# EAGLE schematic STM32F103RB (EAGLE 6.2)
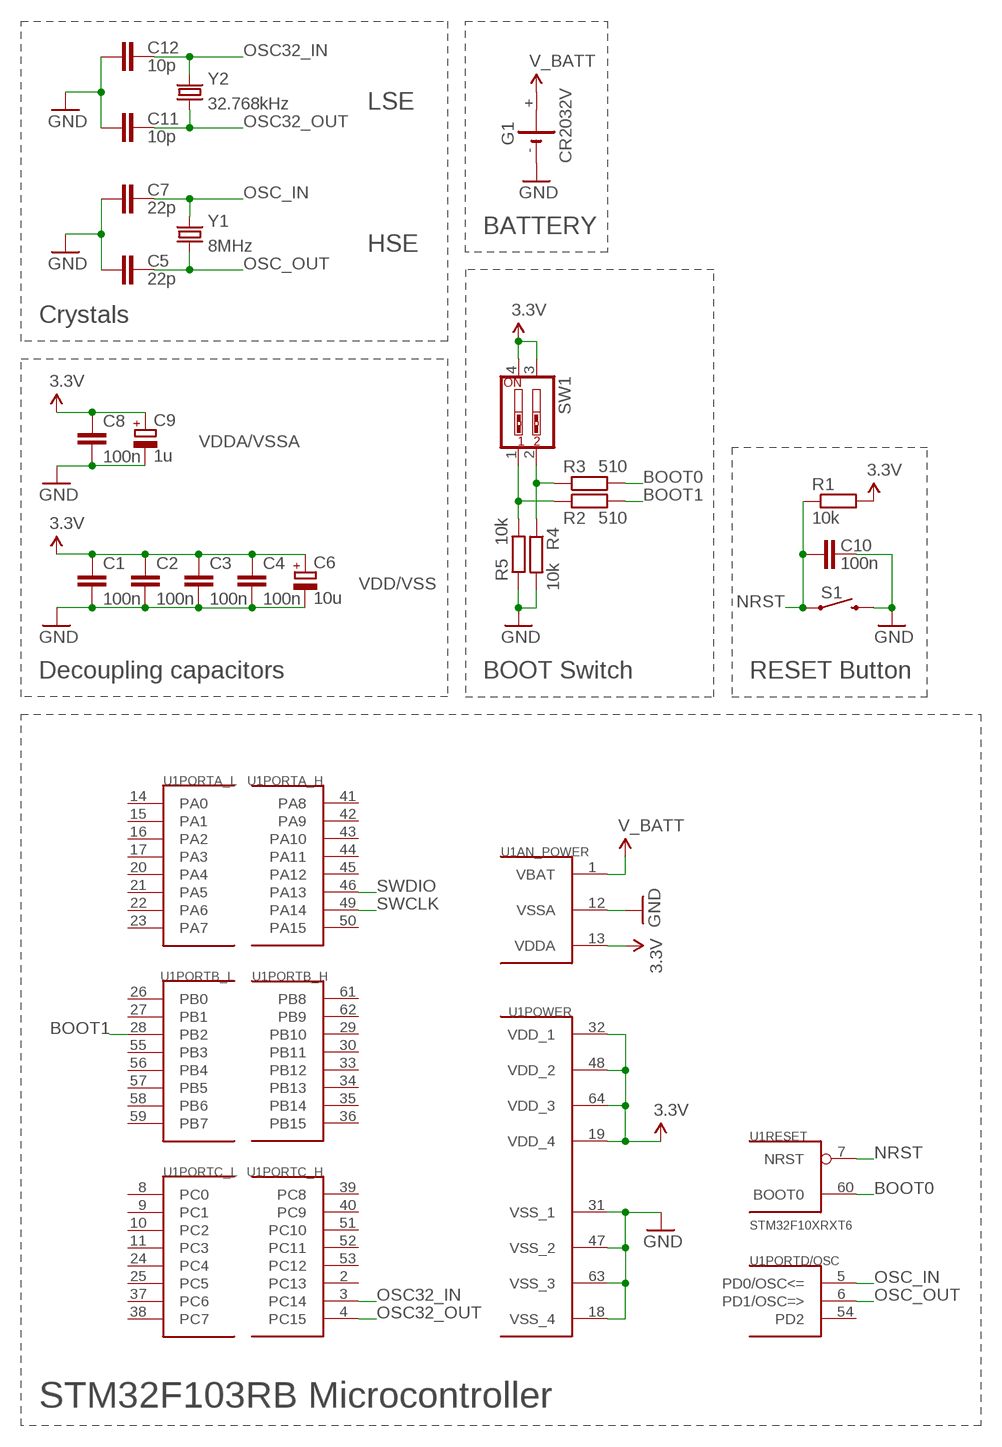
[diagram p0: schematic, sheet 1]

## Parts
C1  100n  C-EUC0805  [C0805]
C2  100n  C-EUC0805  [C0805]
C3  100n  C-EUC0805  [C0805]
C4  100n  C-EUC0805  [C0805]
C5  22p  C-EUC0805  [C0805]
C6  10u  CPOL-EUSMCA  [SMC_A]
C7  22p  C-EUC0805  [C0805]
C8  100n  C-EUC0805  [C0805]
C9  1u  CPOL-EUSMCA  [SMC_A]
C10  100n  C-EUC0805  [C0805]
C11  10p  C-EUC0805  [C0805]
C12  10p  C-EUC0805  [C0805]
G1  CR2032V  [CR2032V]
R1  10k  R-EU_R0805  [R0805]
R2  510  R-EU_R0805  [R0805]
R3  510  R-EU_R0805  [R0805]
R4  10k  R-EU_R0805  [R0805]
R5  10k  R-EU_R0805  [R0805]
S1  SWITCH-MOMENTARY-2-SMD-1101NE  [TACTILE-SWITCH-1101NE]
SW1  SW_DIP-2  [DIPSWITCH-02]
U1  STM32F10XRXT6  [TQFP64]
Y1  8MHz  CRYSTALSMD  [HC49UP]
Y2  32.768kHz  CRYSTALEPSONMC146  [CRYSTAL-32KHZ-SMD_EPSON_MC146]

## Nets
3.3V: C1.1 C2.1 C3.1 C4.1 C6.+ C8.1 C9.+ R1.2 SW1.3 SW1.4 U1.13(AN_POWER:VDDA) U1.19(POWER:VDD_4) U1.32(POWER:VDD_1) U1.48(POWER:VDD_2) U1.64(POWER:VDD_3)
BOOT0: R3.2 U1.60(RESET:BOOT0)
BOOT1: R2.2 U1.28(PORTB_L:PB2)
GND: C5.1 C7.1 C8.2 C9.- C10.2 C11.1 C12.1 G1.- R4.2 R5.1 S1.P$2 U1.12(AN_POWER:VSSA) U1.18(POWER:VSS_4) U1.31(POWER:VSS_1) U1.47(POWER:VSS_2) U1.63(POWER:VSS_3)
N$1: R2.1 R5.2 SW1.1
N$2: R3.1 R4.1 SW1.2
N$4: C1.2 C2.2 C3.2 C4.2 C6.- ; supply symbol labelled GND
NRST: C10.1 R1.1 S1.P$1 U1.7(RESET:NRST)
OSC32_IN: C12.2 U1.3(PORTC_H:PC14) Y2.P$1
OSC32_OUT: C11.2 U1.4(PORTC_H:PC15) Y2.P$2
OSC_IN: C7.2 U1.5(PORTD/OSC:PD0/OSC<=) Y1.2
OSC_OUT: C5.2 U1.6(PORTD/OSC:PD1/OSC=>) Y1.1
SWCLK: U1.49(PORTA_H:PA14)
SWDIO: U1.46(PORTA_H:PA13)
V_BATT: G1.+ U1.1(AN_POWER:VBAT)
Unconnected: G1.+@1(+) U1.2(PORTC_H:PC13) U1.8(PORTC_L:PC0) U1.9(PORTC_L:PC1) U1.10(PORTC_L:PC2) U1.11(PORTC_L:PC3) U1.14(PORTA_L:PA0) U1.15(PORTA_L:PA1) U1.16(PORTA_L:PA2) U1.17(PORTA_L:PA3) U1.20(PORTA_L:PA4) U1.21(PORTA_L:PA5) U1.22(PORTA_L:PA6) U1.23(PORTA_L:PA7) U1.24(PORTC_L:PC4) U1.25(PORTC_L:PC5) U1.26(PORTB_L:PB0) U1.27(PORTB_L:PB1) U1.29(PORTB_H:PB10) U1.30(PORTB_H:PB11) U1.33(PORTB_H:PB12) U1.34(PORTB_H:PB13) U1.35(PORTB_H:PB14) U1.36(PORTB_H:PB15) U1.37(PORTC_L:PC6) U1.38(PORTC_L:PC7) U1.39(PORTC_H:PC8) U1.40(PORTC_H:PC9) U1.41(PORTA_H:PA8) U1.42(PORTA_H:PA9) U1.43(PORTA_H:PA10) U1.44(PORTA_H:PA11) U1.45(PORTA_H:PA12) U1.50(PORTA_H:PA15) U1.51(PORTC_H:PC10) U1.52(PORTC_H:PC11) U1.53(PORTC_H:PC12) U1.54(PORTD/OSC:PD2) U1.55(PORTB_L:PB3) U1.56(PORTB_L:PB4) U1.57(PORTB_L:PB5) U1.58(PORTB_L:PB6) U1.59(PORTB_L:PB7) U1.61(PORTB_H:PB8) U1.62(PORTB_H:PB9)

## Notes on the sheet
- LSE
- BATTERY
- HSE
- Crystals
- VDDA/VSSA
- VDD/VSS
- Decoupling capacitors | BOOT Switch | RESET Button
- STM32F103RB Microcontroller

## Library data of the parts
C1-C5 C7 C8 C10-C12 = rcl:C-EU: CAPACITOR, European symbol
C6 C9 = rcl:CPOL-EU: POLARIZED CAPACITOR, European symbol
G1 = battery:CR2032V: LI BATTERY Varta
R1-R5 = rcl:R-EU_: RESISTOR, European symbol
S1 = SparkFun-Electromechanical:SWITCH-MOMENTARY-2: Various NO switches- pushbuttons, reed, etc
SW1 = SparkFun-Electromechanical:SW_DIP-2: DIP SWITCH
U1 = stm32:STM32F10XRXT6: STM32F101/103 64pin LQFP
Y1 Y2 = SparkFun-FreqCtrl:CRYSTAL: Various standard crystals. Proven footprints. Spark Fun Electronics SKU : COM-00534